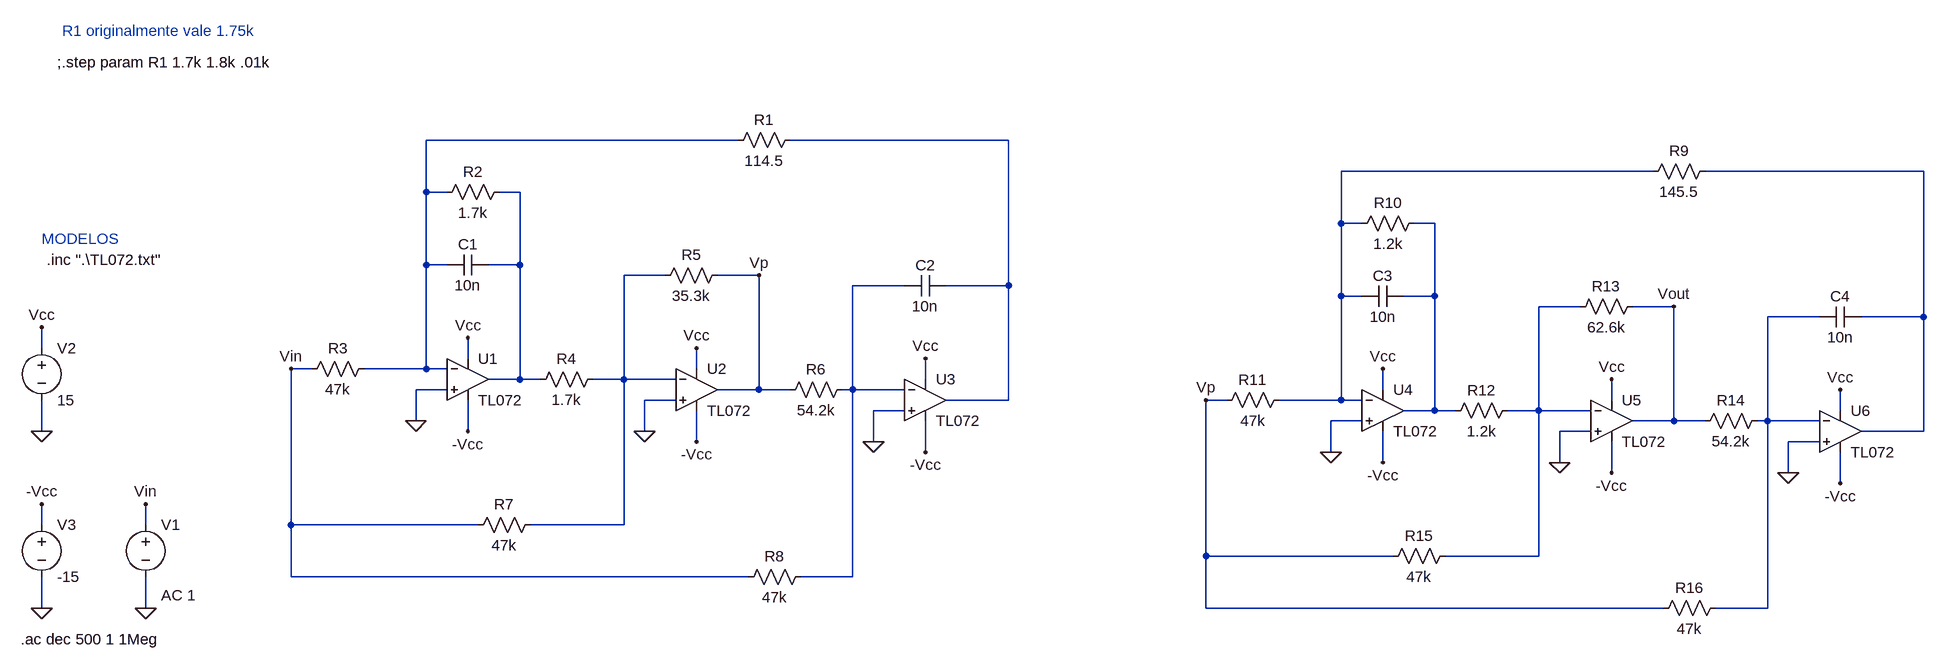
[diagram p0: schematic FT-TL072.asc]
FT-TL072.asc, the LTspice schematic file:
Version 4
SHEET 1 2736 680
WIRE 800 -480 320 -480
WIRE 1216 -480 880 -480
WIRE 2208 -432 1728 -432
WIRE 2624 -432 2288 -432
WIRE 320 -400 320 -480
WIRE 352 -400 320 -400
WIRE 464 -400 432 -400
WIRE 1728 -352 1728 -432
WIRE 1760 -352 1728 -352
WIRE 1872 -352 1840 -352
WIRE 320 -288 320 -400
WIRE 352 -288 320 -288
WIRE 464 -288 464 -400
WIRE 464 -288 416 -288
WIRE 688 -272 624 -272
WIRE 832 -272 768 -272
WIRE 1056 -256 976 -256
WIRE 1216 -256 1216 -480
WIRE 1216 -256 1120 -256
WIRE 1728 -240 1728 -352
WIRE 1760 -240 1728 -240
WIRE 1872 -240 1872 -352
WIRE 1872 -240 1824 -240
WIRE 2096 -224 2032 -224
WIRE 2240 -224 2176 -224
WIRE 2464 -208 2384 -208
WIRE 2624 -208 2624 -432
WIRE 2624 -208 2528 -208
WIRE -272 -160 -272 -192
WIRE 384 -144 384 -176
WIRE 144 -128 112 -128
WIRE 320 -128 320 -288
WIRE 320 -128 224 -128
WIRE 352 -128 320 -128
WIRE 736 -128 736 -160
WIRE 464 -112 464 -288
WIRE 464 -112 416 -112
WIRE 496 -112 464 -112
WIRE 624 -112 624 -272
WIRE 624 -112 576 -112
WIRE 704 -112 624 -112
WIRE 1088 -112 1088 -144
WIRE 352 -96 304 -96
WIRE 832 -96 832 -272
WIRE 832 -96 768 -96
WIRE 880 -96 832 -96
WIRE 976 -96 976 -256
WIRE 976 -96 960 -96
WIRE 1056 -96 976 -96
WIRE 1792 -96 1792 -128
WIRE 704 -80 656 -80
WIRE 1216 -80 1216 -256
WIRE 1216 -80 1120 -80
WIRE 1552 -80 1520 -80
WIRE 1728 -80 1728 -240
WIRE 1728 -80 1632 -80
WIRE 1760 -80 1728 -80
WIRE 2144 -80 2144 -112
WIRE 1056 -64 1008 -64
WIRE 1872 -64 1872 -240
WIRE 1872 -64 1824 -64
WIRE 1904 -64 1872 -64
WIRE 2032 -64 2032 -224
WIRE 2032 -64 1984 -64
WIRE 2112 -64 2032 -64
WIRE 2496 -64 2496 -96
WIRE 304 -48 304 -96
WIRE 1760 -48 1712 -48
WIRE 2240 -48 2240 -224
WIRE 2240 -48 2176 -48
WIRE 2288 -48 2240 -48
WIRE 2384 -48 2384 -208
WIRE 2384 -48 2368 -48
WIRE 2464 -48 2384 -48
WIRE -272 -32 -272 -80
WIRE 384 -32 384 -80
WIRE 656 -32 656 -80
WIRE 2112 -32 2064 -32
WIRE 2624 -32 2624 -208
WIRE 2624 -32 2528 -32
WIRE 736 -16 736 -64
WIRE 1008 -16 1008 -64
WIRE 2464 -16 2416 -16
WIRE 1088 0 1088 -48
WIRE 1712 0 1712 -48
WIRE 1792 16 1792 -32
WIRE 2064 16 2064 -32
WIRE 2144 32 2144 -16
WIRE 2416 32 2416 -16
WIRE 2496 48 2496 0
WIRE -272 112 -272 80
WIRE -112 112 -112 80
WIRE 112 112 112 -128
WIRE 400 112 112 112
WIRE 624 112 624 -112
WIRE 624 112 480 112
WIRE 1520 160 1520 -80
WIRE 1808 160 1520 160
WIRE 2032 160 2032 -64
WIRE 2032 160 1888 160
WIRE 112 192 112 112
WIRE 816 192 112 192
WIRE 976 192 976 -96
WIRE 976 192 896 192
WIRE -272 240 -272 192
WIRE -112 240 -112 192
WIRE 1520 240 1520 160
WIRE 2224 240 1520 240
WIRE 2384 240 2384 -48
WIRE 2384 240 2304 240
FLAG -272 80 -Vcc
FLAG -272 -192 Vcc
FLAG -272 -32 0
FLAG -272 240 0
FLAG 384 -176 Vcc
FLAG 384 -32 -Vcc
FLAG 304 -48 0
FLAG 736 -160 Vcc
FLAG 736 -16 -Vcc
FLAG 656 -32 0
FLAG 1088 -144 Vcc
FLAG 1088 0 -Vcc
FLAG 1008 -16 0
FLAG -112 240 0
FLAG -112 80 Vin
FLAG 112 -128 Vin
FLAG 1792 -128 Vcc
FLAG 1792 16 -Vcc
FLAG 1712 0 0
FLAG 2144 -112 Vcc
FLAG 2144 32 -Vcc
FLAG 2064 16 0
FLAG 2496 -96 Vcc
FLAG 2496 48 -Vcc
FLAG 2416 32 0
FLAG 2240 -224 Vout
FLAG 832 -272 Vp
FLAG 1520 -80 Vp
SYMBOL voltage -272 -176 R0
SYMATTR InstName V2
SYMATTR Value 15
SYMBOL voltage -272 96 R0
SYMATTR InstName V3
SYMATTR Value -15
SYMBOL Opamps\\opamp2 384 -176 R0
SYMATTR InstName U1
SYMATTR Value TL072
SYMBOL Opamps\\opamp2 736 -160 R0
SYMATTR InstName U2
SYMATTR Value TL072
SYMBOL Opamps\\opamp2 1088 -144 R0
SYMATTR InstName U3
SYMATTR Value TL072
SYMBOL cap 416 -304 R90
WINDOW 0 0 32 VBottom 2
WINDOW 3 32 32 VTop 2
SYMATTR InstName C1
SYMATTR Value 10n
SYMBOL res 896 -496 R90
WINDOW 0 0 56 VBottom 2
WINDOW 3 32 56 VTop 2
SYMATTR InstName R1
SYMATTR Value 114.5
SYMBOL res 448 -416 R90
WINDOW 0 0 56 VBottom 2
WINDOW 3 32 56 VTop 2
SYMATTR InstName R2
SYMATTR Value 1.7k
SYMBOL res 240 -144 R90
WINDOW 0 0 56 VBottom 2
WINDOW 3 32 56 VTop 2
SYMATTR InstName R3
SYMATTR Value 47k
SYMBOL res 592 -128 R90
WINDOW 0 0 56 VBottom 2
WINDOW 3 32 56 VTop 2
SYMATTR InstName R4
SYMATTR Value 1.7k
SYMBOL res 784 -288 R90
WINDOW 0 0 56 VBottom 2
WINDOW 3 32 56 VTop 2
SYMATTR InstName R5
SYMATTR Value 35.3k
SYMBOL res 976 -112 R90
WINDOW 0 0 56 VBottom 2
WINDOW 3 32 56 VTop 2
SYMATTR InstName R6
SYMATTR Value 54.2k
SYMBOL res 496 96 R90
WINDOW 0 0 56 VBottom 2
WINDOW 3 32 56 VTop 2
SYMATTR InstName R7
SYMATTR Value 47k
SYMBOL res 912 176 R90
WINDOW 0 0 56 VBottom 2
WINDOW 3 32 56 VTop 2
SYMATTR InstName R8
SYMATTR Value 47k
SYMBOL cap 1120 -272 R90
WINDOW 0 0 32 VBottom 2
WINDOW 3 32 32 VTop 2
SYMATTR InstName C2
SYMATTR Value 10n
SYMBOL voltage -112 96 R0
WINDOW 123 24 124 Left 2
WINDOW 39 0 0 Left 0
SYMATTR Value2 AC 1
SYMATTR InstName V1
SYMATTR Value ""
SYMBOL Opamps\\opamp2 1792 -128 R0
SYMATTR InstName U4
SYMATTR Value TL072
SYMBOL Opamps\\opamp2 2144 -112 R0
SYMATTR InstName U5
SYMATTR Value TL072
SYMBOL Opamps\\opamp2 2496 -96 R0
SYMATTR InstName U6
SYMATTR Value TL072
SYMBOL cap 1824 -256 R90
WINDOW 0 0 32 VBottom 2
WINDOW 3 32 32 VTop 2
SYMATTR InstName C3
SYMATTR Value 10n
SYMBOL res 2304 -448 R90
WINDOW 0 0 56 VBottom 2
WINDOW 3 32 56 VTop 2
SYMATTR InstName R9
SYMATTR Value 145.5
SYMBOL res 1856 -368 R90
WINDOW 0 0 56 VBottom 2
WINDOW 3 32 56 VTop 2
SYMATTR InstName R10
SYMATTR Value 1.2k
SYMBOL res 1648 -96 R90
WINDOW 0 0 56 VBottom 2
WINDOW 3 32 56 VTop 2
SYMATTR InstName R11
SYMATTR Value 47k
SYMBOL res 2000 -80 R90
WINDOW 0 0 56 VBottom 2
WINDOW 3 32 56 VTop 2
SYMATTR InstName R12
SYMATTR Value 1.2k
SYMBOL res 2192 -240 R90
WINDOW 0 0 56 VBottom 2
WINDOW 3 32 56 VTop 2
SYMATTR InstName R13
SYMATTR Value 62.6k
SYMBOL res 2384 -64 R90
WINDOW 0 0 56 VBottom 2
WINDOW 3 32 56 VTop 2
SYMATTR InstName R14
SYMATTR Value 54.2k
SYMBOL res 1904 144 R90
WINDOW 0 0 56 VBottom 2
WINDOW 3 32 56 VTop 2
SYMATTR InstName R15
SYMATTR Value 47k
SYMBOL res 2320 224 R90
WINDOW 0 0 56 VBottom 2
WINDOW 3 32 56 VTop 2
SYMATTR InstName R16
SYMATTR Value 47k
SYMBOL cap 2528 -224 R90
WINDOW 0 0 32 VBottom 2
WINDOW 3 32 32 VTop 2
SYMATTR InstName C4
SYMATTR Value 10n
TEXT -264 -296 Left 2 !.inc ".\\TL072.txt"
TEXT -272 -328 Left 2 ;MODELOS
TEXT -248 -600 Left 2 !;.step param R1 1.7k 1.8k .01k
TEXT -240 -648 Left 2 ;R1 originalmente vale 1.75k
TEXT -304 288 Left 2 !.ac dec 500 1 1Meg

The netlist it stands for:
* FT-TL072.asc
V2 Vcc 0 15
V3 -Vcc 0 -15
XU1 0 N001 Vcc -Vcc N005 TL072  ; pins In+ In- V+ V- OUT
XU2 0 N007 Vcc -Vcc Vp TL072  ; pins In+ In- V+ V- OUT
XU3 0 N008 Vcc -Vcc N002 TL072  ; pins In+ In- V+ V- OUT
C1 N005 N001 10n
R1 N002 N001 114.5
R2 N005 N001 1.7k
R3 N001 Vin 47k
R4 N007 N005 1.7k
R5 Vp N007 35.3k
R6 N008 Vp 54.2k
R7 N007 Vin 47k
R8 N008 Vin 47k
C2 N002 N008 10n
V1 Vin 0 AC 1
XU4 0 N003 Vcc -Vcc N006 TL072  ; pins In+ In- V+ V- OUT
XU5 0 N009 Vcc -Vcc Vout TL072  ; pins In+ In- V+ V- OUT
XU6 0 N010 Vcc -Vcc N004 TL072  ; pins In+ In- V+ V- OUT
C3 N006 N003 10n
R9 N004 N003 145.5
R10 N006 N003 1.2k
R11 N003 Vp 47k
R12 N009 N006 1.2k
R13 Vout N009 62.6k
R14 N010 Vout 54.2k
R15 N009 Vp 47k
R16 N010 Vp 47k
C4 N004 N010 10n
.inc ".\TL072.txt"
* MODELOS
;.step param R1 1.7k 1.8k .01k
* R1 originalmente vale 1.75k
.ac dec 500 1 1Meg
.backanno
.end